# EAGLE schematic perfusion_esquematico (EAGLE 9.4.2)
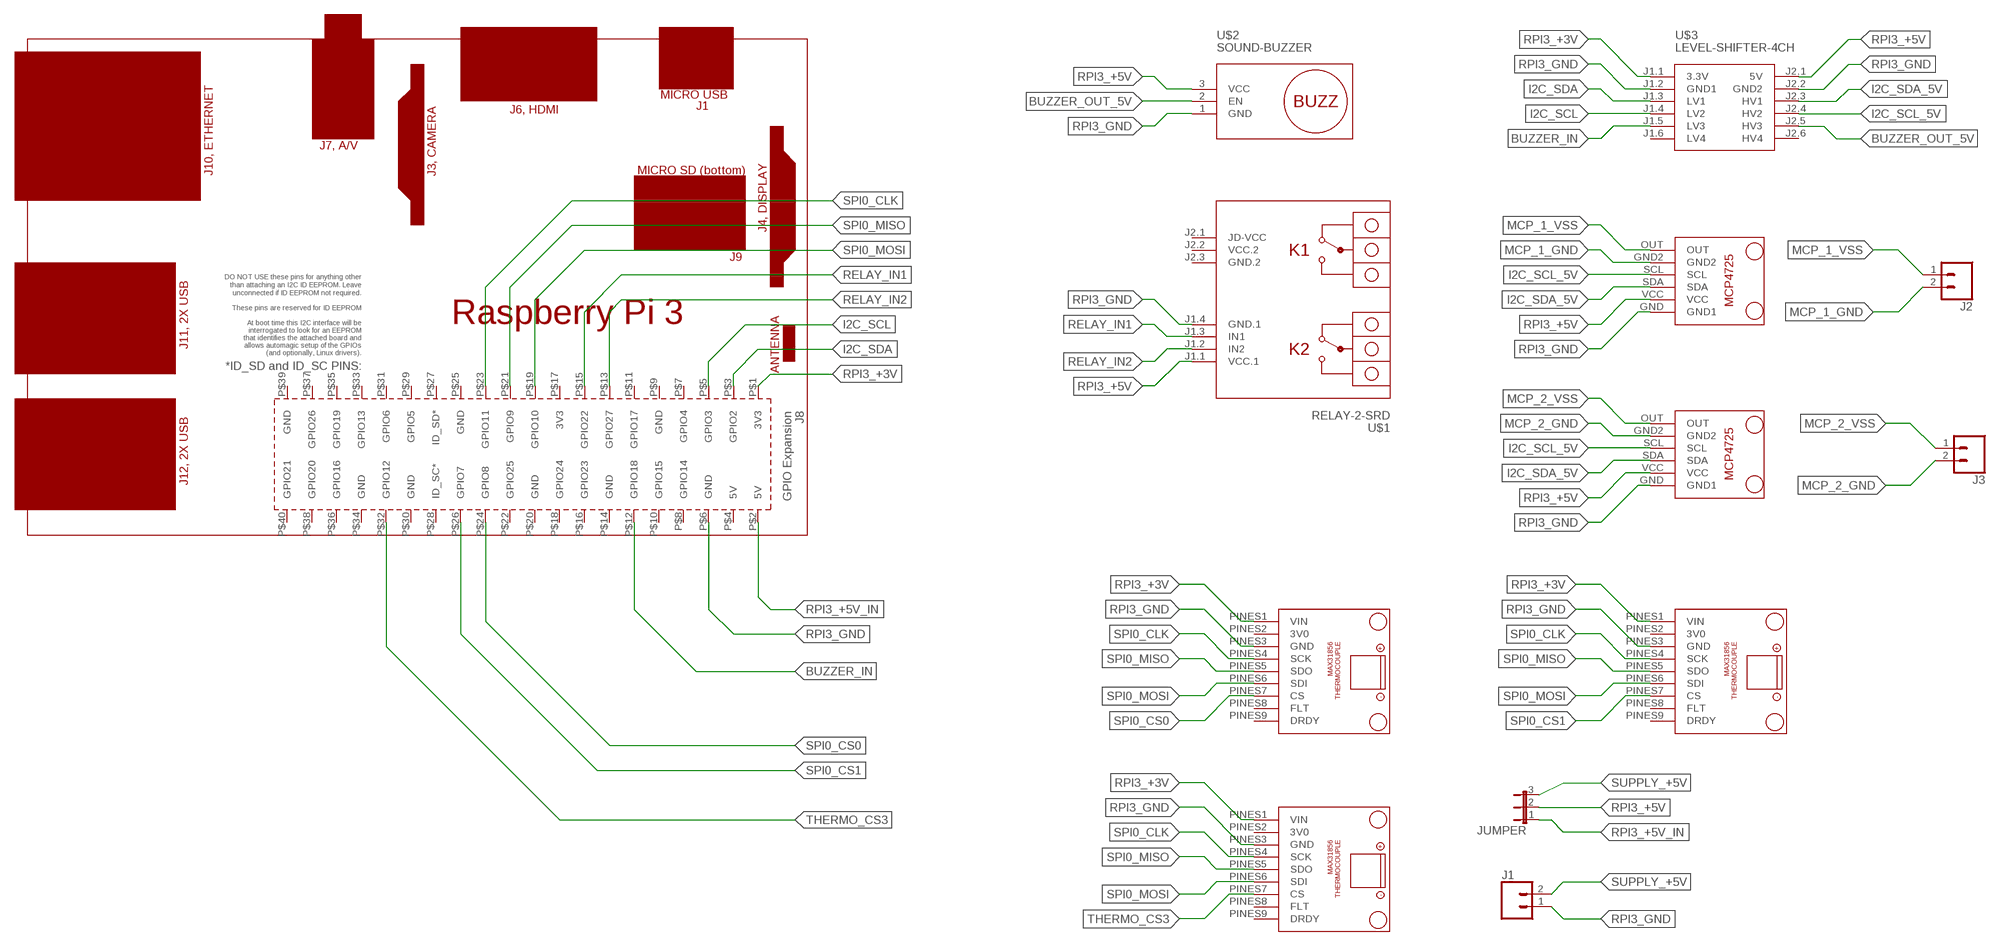
[diagram p0: schematic, sheet 1]

## Parts
J1  CONN_023.5MM_LOCK  [SCREWTERMINAL-3.5MM-2_LOCK]
J2  CONN_023.5MM_LOCK  [SCREWTERMINAL-3.5MM-2_LOCK]
J3  CONN_023.5MM_LOCK  [SCREWTERMINAL-3.5MM-2_LOCK]
JUMPER  JP2E  [JP2]
PCB1  RPI3  [RPI3]
U$1  RELAY-2-SRD  [RELAY-2-SRD]
U$2  SOUND-BUZZER  [SOUND-BUZZER]
U$3  LEVEL-SHIFTER-4CH  [LEVEL-SHIFTER-4CH]
U$4  MAX31856  [MAX31856]
U$5  MAX31856  [MAX31856]
U$6  MAX31856  [MAX31856]
U$7  LIB1MCP4725_ABF  [LIB1]
U$8  LIB1MCP4725_ABF  [LIB1]

## Nets
BUZZER_IN: PCB1.P$12(GPIO18) U$3.J1.5(LV3)
BUZZER_OUT_5V: U$2.2(EN) U$3.J2.5(HV3)
I2C_SCL: PCB1.P$5(GPIO3) U$3.J1.4(LV2)
I2C_SCL_5V: U$3.J2.4(HV2) U$7.SCL U$8.SCL
I2C_SDA: PCB1.P$3(GPIO2) U$3.J1.3(LV1)
I2C_SDA_5V: U$3.J2.3(HV1) U$7.SDA U$8.SDA
MCP_1_GND: J2.2 U$8.GND2
MCP_1_VSS: J2.1 U$8.OUT
MCP_2_GND: J3.2 U$7.GND2
MCP_2_VSS: J3.1 U$7.OUT
RELAY_IN1: PCB1.P$15(GPIO22) U$1.J1.3(IN1)
RELAY_IN2: PCB1.P$13(GPIO27) U$1.J1.2(IN2)
RPI3_+3V: PCB1.P$1(3V3) U$3.J1.1(3.3V) U$4.PINES1(VIN) U$5.PINES1(VIN) U$6.PINES1(VIN)
RPI3_+5V: JUMPER.2 U$1.J1.1(VCC.1) U$2.3(VCC) U$3.J2.1(5V) U$7.VCC U$8.VCC
RPI3_+5V_IN: JUMPER.1 PCB1.P$2(5V)
RPI3_GND: J1.1 PCB1.P$6(GND) U$1.J1.4(GND.1) U$2.1(GND) U$3.J1.2(GND1) U$3.J2.2(GND2) U$4.PINES3(GND) U$5.PINES3(GND) U$6.PINES3(GND) U$7.GND(GND1) U$8.GND(GND1)
SPI0_CLK: PCB1.P$23(GPIO11) U$4.PINES4(SCK) U$5.PINES4(SCK) U$6.PINES4(SCK)
SPI0_CS0: PCB1.P$24(GPIO8) U$4.PINES7(CS)
SPI0_CS1: PCB1.P$26(GPIO7) U$5.PINES7(CS)
SPI0_MISO: PCB1.P$21(GPIO9) U$4.PINES5(SDO) U$5.PINES5(SDO) U$6.PINES5(SDO)
SPI0_MOSI: PCB1.P$19(GPIO10) U$4.PINES6(SDI) U$5.PINES6(SDI) U$6.PINES6(SDI)
SUPPLY_+5V: J1.2 JUMPER.3
THERMO_CS3: PCB1.P$32(GPIO12) U$6.PINES7(CS)
Unconnected: PCB1.P$4(5V) PCB1.P$7(GPIO4) PCB1.P$8(GPIO14) PCB1.P$9(GND) PCB1.P$10(GPIO15) PCB1.P$11(GPIO17) PCB1.P$14(GND) PCB1.P$16(GPIO23) PCB1.P$17(3V3) PCB1.P$18(GPIO24) PCB1.P$20(GND) PCB1.P$22(GPIO25) PCB1.P$25(GND) PCB1.P$27(ID_SD*) PCB1.P$28(ID_SC*) PCB1.P$29(GPIO5) PCB1.P$30(GND) PCB1.P$31(GPIO6) PCB1.P$33(GPIO13) PCB1.P$34(GND) PCB1.P$35(GPIO19) PCB1.P$36(GPIO16) PCB1.P$37(GPIO26) PCB1.P$38(GPIO20) PCB1.P$39(GND) PCB1.P$40(GPIO21) U$1.J2.1(JD-VCC) U$3.J1.6(LV4) U$3.J2.6(HV4) U$4.PINES2(3V0) U$4.PINES8(FLT) U$4.PINES9(DRDY) U$5.PINES2(3V0) U$5.PINES8(FLT) U$5.PINES9(DRDY) U$6.PINES2(3V0) U$6.PINES8(FLT) U$6.PINES9(DRDY)

## Power pins joined to a net without a drawn wire
GND.2: U$1.J2.3(GND.2)
VCC.2: U$1.J2.2(VCC.2)

## Library data of the parts
J1-J3 = SparkFun-Connectors:CONN_02: Multi connection point. Often used as Generic Header-pin footprint for 0.1 inch spaced/style header connections On any of the 0.1 inch spaced packages, you can populate with these: Break Away Headers - Straight <https://www.sparkfun.com/products/116> (PRT-00116) Break Away Male Headers - Right Angle <https://www.sparkfun.com/products/553> (PRT-00553) Female Headers <https://www.sparkfun.com/products/115> (PRT-00115) Break Away Headers - Machine Pin <https://www.sparkfun.com/products/117> (PRT-00117) Break Away Female Headers - Swiss Machine Pin <https://www.sparkfun.com/products/743> (PRT-00743) For SCREWTERMINALS and SPRING TERMINALS visit here: Screw Terimnals on SparkFun.com <https://www.sparkfun.com/search/results?term=Screw+Terminals> (5mm/3.5mm/2.54mm spacing) This device is also useful as a general connection point to wire up your design to another part of your project. Our various solder wires solder well into these plated through hole pads. Hook-Up Wire - Assortment (Stranded, 22 AWG) <https://www.sparkfun.com/products/11375> (PRT-11375) Hook-Up Wire - Assortment (Solid Core, 22 AWG) <https://www.sparkfun.com/products/11367> (PRT-11367) View the entire wire category on our website here <https://www.sparkfun.com/categories/141> Special notes: Molex polarized connector foot print use with: PRT-08233 with associated crimp pins and housings. 2.54_SCREWTERM for use with PRT-10571. 3.5mm Screw Terminal footprints for PRT-08084 5mm Screw Terminal footprints for use with PRT-08432; PROD_ID: CONN-08399
JUMPER = jumper:JP2E: JUMPER
PCB1 = e14_Rpi3_RevA:RPI3: Device for Raspberry Pi 3 board created by Dave Young for www.element14.com More information and support community is available at https://www.element14.com/community/community/raspberry-pi
U$1 = diy-modules:RELAY-2-SRD: 2-Channel Relay Module based on SRD-05VDC-SL-C relays Click here to find device on ebay.com <http://www.ebay.com/sch/two+channel+relay+module+optocoupler+5v>
U$2 = diy-modules:SOUND-BUZZER: Sound Buzzer Module Click here to find device on ebay.com <http://www.ebay.com/sch/passive+buzzer+beep+module>
U$3 = diy-modules:LEVEL-SHIFTER-4CH: 4-Channel Bi-Directional Logic Level Converter based on BSS128 transistors Click here to find device on ebay.com <http://www.ebay.com/sch/i2c+logic+converter+module>
U$4-U$6 = max31856_libreria:MAX31856
U$7 U$8 = mcp4725_alberto:LIB1

## Net classes
0 default: width 0.61 mm, clearance 0.508 mm